# Altium project TIPD156 Project.PrjPcb
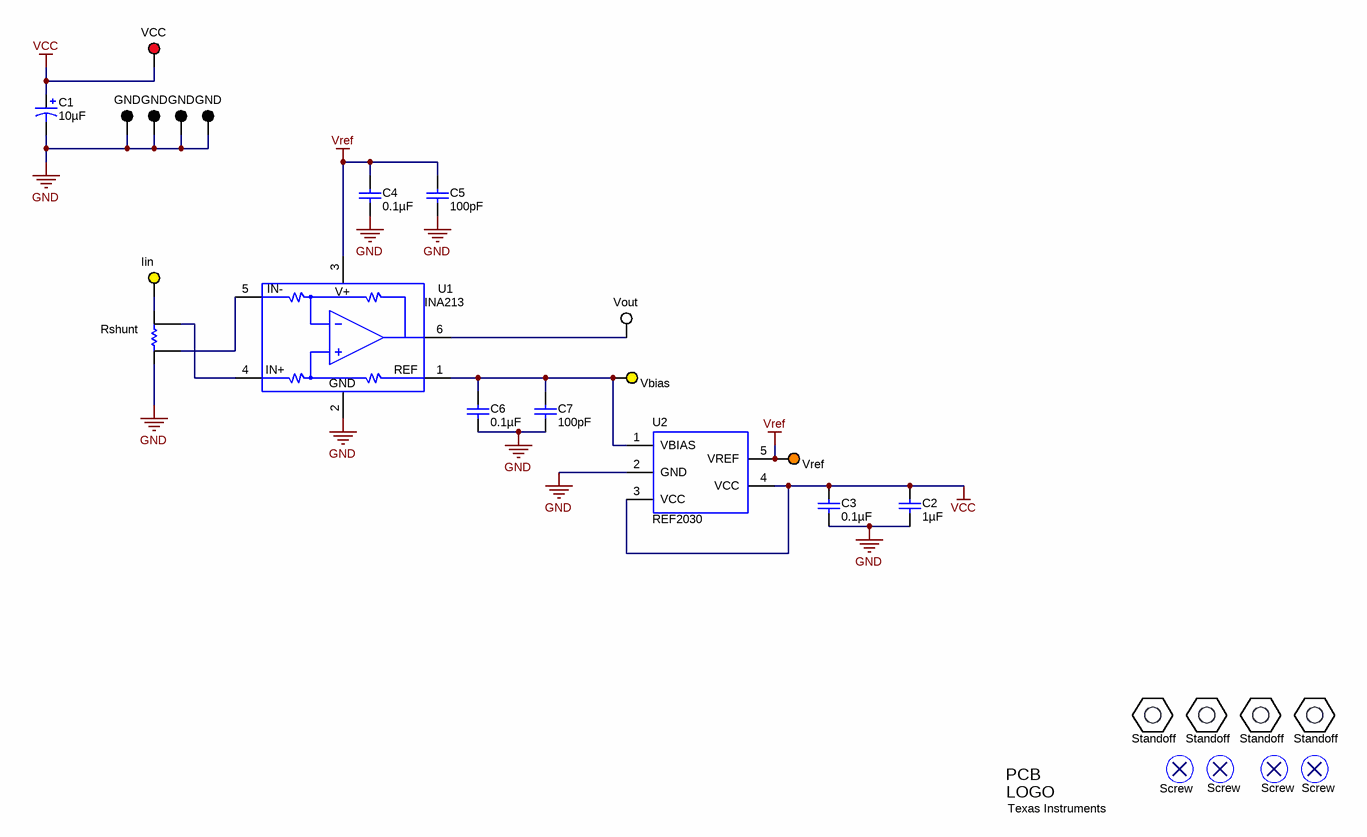
[diagram p0: TIPD156 SCH.SchDoc]
CopyrightYear: 2014; PRJ_Customer: Precision Linear; PRJ_Title: TI Designs - Precision; SCH_Rev: 0; TechSupport: http://e2e.ti.com
1 sheet, 28 parts. Net scope: global (net labels, ports and power ports of the same name join across sheets).
Board file: TIPD156 PCB.PcbDoc

## Sheet TIPD156 SCH.SchDoc: Schematic for TIPD156
size B; Date: Not shown in title block; ApprovedBy: Not shown in title block; CheckedBy: Not shown in title block; Author: Not shown in title block; CompanyName: Not shown in title block; DrawnBy: Not shown in title block; Engineer: Not shown in title block; Organization: Not shown in title block; Address1: Not shown in title block; Address2: Not shown in title block; Address3: Not shown in title block; Address4: Not shown in title block; DocumentNumber: 1; Revision: Use project parameter SCH_Rev; SheetNumber: 1; SheetTotal: 1; PageSetup: Record=PageOptions|CenterHorizontal=True|CenterVertical=True|PrintScale=0.72|XCorrection=1.00|YCorrection=1.00|PrintKind=0|BorderSize=5000000|LeftOffset=0|BottomOffset=0|Orientation=2|PaperLength=1000|PaperWidth=1000|Scale=100|PaperSource=15|PrintQuality=600|MediaType=1|DitherType=10|PaperKind=Letter|PrintScaleMode=1; CurrentTime: Not shown in title block; CurrentDate: Not shown in title block; Time: Not shown in title block; DocumentFullPathAndName: Not shown in title block; DocumentName: Not shown in title block; ModifiedDate: Not shown in title block; ImagePath: Not shown in title block

### Parts
C1  ValueDisplayed: 10µF  [6032-28]  (hidden comment: TPSC106K025R0500)
C2  ValueDisplayed: 1µF  [0603]  (hidden comment: C1608X7R1C105K)
C3  ValueDisplayed: 0.1µF  [0603]  (hidden comment: 06033C104KAT2A)
C4  ValueDisplayed: 0.1µF  [0603]  (hidden comment: 06033C104KAT2A)
C5  ValueDisplayed: 100pF  [0603]  (hidden comment: 06035A101JAT2A)
C6  ValueDisplayed: 0.1µF  [0603]  (hidden comment: 06033C104KAT2A)
C7  ValueDisplayed: 100pF  [0603]  (hidden comment: 06035A101JAT2A)
Logo1  Texas Instruments  [TI_Symbol_Overlay_Small]  (no BOM)
Rshunt  (no value)  [CSM2512]
TP1  Vout  [Keystone5007]
TP2  VCC  [Keystone5005]
TP3  GND  [Keystone5006]
TP4  GND  [Keystone5006]
TP5  GND  [Keystone5006]
TP6  GND  [Keystone5006]
TP7  Vbias  [Keystone5009]
TP8  Vref  [Keystone5008]
TP9  Iin  [Keystone5009]
U1  INA213  [SC70-6 (DCK) Low Density]
U2  REF2030  [SOT23-5 (DBV) low density]
U90  Standoff  [STANDOFF HEX 4-40THR ALUM 1"L]
U91  Standoff  [STANDOFF HEX 4-40THR ALUM 1"L]
U92  Standoff  [STANDOFF HEX 4-40THR ALUM 1"L]
U93  Standoff  [STANDOFF HEX 4-40THR ALUM 1"L]
U94  Screw  (mechanical)
U95  Screw  (mechanical)
U96  Screw  (mechanical)
U97  Screw  (mechanical)

### Nets
GND: C1.2(-) C2.2 C3.2 C4.2 C5.2 C6.2 C7.2 Rshunt.I2 TP3.1 TP4.1 TP5.1 TP6.1 U1.2(GND) U2.2(GND)
VCC: C1.1(+) C2.1 C3.1 TP2.1 U2.3(VCC) U2.4(VCC)
Vref: C4.1 C5.1 TP8.1 U1.3(V+) U2.5(VREF)
NetC6_1: C6.1 C7.1 TP7.1 U1.1 U2.1(VBIAS)
NetRshunt_E1: Rshunt.E1 U1.4
NetRshunt_E2: Rshunt.E2 U1.5
NetRshunt_I1: Rshunt.I1 TP9.1
NetTP1_1: TP1.1 U1.6

### Notes on the sheet
- Project:
- Designed for:
- Mod. Date:
- Sheet Title:
- Size:
- File:
- Assembly Variant:
- B
- Schematic:
- 870
- Rev:
- Sheet:
- of
- http://www.ti.com
- Texas Instruments and/or its licensors do not warrant the accuracy or completeness of this specification or any information contained therein. Texas Instruments and/or its licensors do not warrant that this design will meet the specifications, will be suitable for your application or fit for any particular purpose, or will operate in an implementation. Texas Instruments and/or its licensors do not warrant that the design is production worthy. You should completely validate and test your design implementation to confirm the system functionality for your application.
- Contact:
- © Texas Instruments
- (in symbol INA213) IN-; IN+; REF
- (in symbol TI_Logo) PCB; LOGO

### Library data of the parts
C1 = TPSC106K025R0500: CAP, TA, 10uF, 25V, +/-10%, 0.5 ohm, SMD; Manufacturer: AVX; Polarized: Y; CompType: Capacitor; U/M: EA; Cap_F: 0.00001; Tolerance_%: 10; Value1: 0.5 ohm; VDC_V: 25; ESR_Ohm: 0.5; IRMS_A: 0.422; TaMin_C: -55; TaMax_C: 125; Cap_Case: C; SymbolVersion: 2008-07-09; Value: 10uF; PartNumber: TPSC106K025R0500; PackageReference: 6032-28; RoHS: Y; Value2: 25V; MountType: SMT; Technology: TA; Series: TPS; Publisher: Texas Instruments; LatestRevisionDate: 2014-02-11; LatestRevisionNote: Updated supplier links; ComponentLink1Description: Datasheet link; ComponentLink1URL: http://www.avx.com/docs/masterpubs/tantniob.pdf; Supplier 1: Digi-Key; Supplier Part Number 1: 478-1762-1-ND; Supplier 2: Mouser; Supplier Part Number 2: 581-TPSC106K025R0500; Supplier 3: Farnell; Supplier Part Number 3: 570450
C2 = C1608X7R1C105K: CAP, CERM, 1uF, 16V, +/-10%, X7R, 0603; Manufacturer: TDK; Polarized: N; CompType: Capacitor; U/M: EA; Cap_F: 0.000001; Tolerance_%: 10; ESR_Ohm: 0.0057; Value1: 0.0057 ohm; VDC_V: 16; TaMin_C: -55; TaMax_C: 125; SymbolVersion: 2008-07-09; Value: 1uF; PartNumber: C1608X7R1C105K; PackageReference: 0603; RoHS: Y; Value2: 16V; MountType: SMT; Technology: Ceramic; TempCo: X7R; Cap_Case: 0603; Published: 2008-06-19; Publisher: Texas Instruments; LatestRevisionDate: 2014-02-27; ComponentLink1Description: Datasheet link; ComponentLink1URL: http://www.tdk.co.jp/tefe02/e412_c.pdf; Supplier 1: Digi-Key; Supplier Part Number 1: 445-1604-1-ND; Supplier 2: Farnell; Supplier Part Number 2: 1907343
C3 C4 C6 = 06033C104KAT2A: CAP, CERM, 0.1uF, 25V, +/-10%, X7R, 0603; Manufacturer: AVX; Polarized: N; CompType: Capacitor; U/M: EA; Cap_F: 0.0000001; Tolerance_%: 10; ESR_Ohm: 0.05; Value1: 0.05 ohm; VDC_V: 25; TaMin_C: -55; TaMax_C: 125; SymbolVersion: 2008-07-09; Value: 0.1uF; PartNumber: 06033C104KAT2A; PackageReference: 0603; RoHS: Y; Value2: 25V; MountType: SMT; Technology: Ceramic; TempCo: X7R; Cap_Case: 0603; Published: 2008-06-19; Publisher: Texas Instruments; LatestRevisionDate: 2014-02-27; ComponentLink1Description: Datasheet link; ComponentLink1URL: http://www.avx.com/docs/masterpubs/smccp.pdf; Supplier 1: Digi-Key; Supplier Part Number 1: 478-3714-1-ND; Supplier 2: Mouser; Supplier Part Number 2: 581-06033C104KAT2A; Supplier 3: Farnell; Supplier Part Number 3: 1396406
C5 C7 = 06035A101JAT2A: CAP, CERM, 100pF, 50V, +/-5%, C0G/NP0, 0603; Manufacturer: AVX; Polarized: N; CompType: Capacitor; U/M: EA; Cap_F: 0.0000000001; Tolerance_%: 5; ESR_Ohm: 0.119; Value1: 0.119 ohm; VDC_V: 50; TaMin_C: -55; TaMax_C: 125; SymbolVersion: 2008-07-09; Value: 100pF; PartNumber: 06035A101JAT2A; PackageReference: 0603; RoHS: Y; Value2: 50V; MountType: SMT; Technology: Ceramic; TempCo: C0G/NP0; Cap_Case: 0603; Published: 2008-06-19; Publisher: Texas Instruments; LatestRevisionDate: 2014-02-27; ComponentLink1Description: Datasheet link; ComponentLink1URL: http://www.avx.com/docs/masterpubs/smccp.pdf; Supplier 1: Digi-Key; Supplier Part Number 1: 478-1175-1-ND; Supplier 2: Mouser; Supplier Part Number 2: 581-06035A101J; Supplier 3: Farnell; Supplier Part Number 3: 499122
Logo1 = TI_Logo: Texas Instrument Corporate Signature; SymbolCreator: codlsc; SymbolVersion: 2011-08-22; ClassName: Logo; Published: 2009-03-03; Publisher: Texas Instruments; LatestRevisionDate: 2012-05-17; LatestRevisionNote: Changed publisher
Rshunt = 10m ohm shunt resistor: RES, 0.010 ohm, 0.1%, 1W, CSM2512; Res_ohm: 0.010; Tolerance_%: 1; U/M: EA; Value: 0.010; CompType: Resistor; SymbolVersion: 2009-05-29; PackageReference: CSM2512; RoHS: Y; Power_W: 1; MountType: SMT; Technology: Thick Film; Published: 2008-06-26; Publisher: Texas Instruments; LatestRevisionDate: 2014-02-25; ComponentLink1Description: Datasheet link
TP1 = 5007: Test Point, Compact, White, TH; Manufacturer: Keystone; CompType: Test Point Loop; U/M: EA; SymbolVersion: 2008-04-04; PartNumber: 5007; Value: White; PackageReference: White Compact Testpoint; RoHS: Y; MountType: TH; ComponentLink1Description: Datasheet Link; ComponentLink1URL: http://www.keyelco.com/userAssets/file/M60-2p60.pdf; Publisher: Texas Instruments; LatestRevisionDate: 2014-02-28; Supplier 1: Digi-Key; Supplier Part Number 1: 5007K-ND
TP2 = 5005: Test Point, TH, Compact, Red; Manufacturer: Keystone; Alternate Manufacturer: Any; Alternate PartNumber: Equivalent; CompType: Test Point Loop; U/M: EA; RoHS: Y; DigiKeyPartNumber: 5005K-ND; Value: Red; SymbolVersion: 2008-04-04; PartNumber: 5005; PackageReference: Keystone5005; ComponentLink1Description: Datasheet Link; ComponentLink1URL: http://www.keyelco.com/pdfs/M55p51.pdf; MountType: TH; Publisher: Texas Instruments; LatestRevisionDate: 2012-07-13; LatestRevisionNote: Changed publisher; Supplier 1: Digi-Key; Supplier Part Number 1: 5005K-ND
TP3-TP6 = 5006: Test Point, TH, Compact, Black; Manufacturer: Keystone; Alternate Manufacturer: Any; Alternate PartNumber: Equivalent; CompType: Test Point Loop; U/M: EA; RoHS: Y; DigiKeyPartNumber: 5006K-ND; Value: Black; SymbolVersion: 2008-04-04; PartNumber: 5006; PackageReference: Keystone5006; ComponentLink1Description: Datasheet Link; ComponentLink1URL: http://www.keyelco.com/pdfs/M55p51.pdf; MountType: TH; Publisher: Texas Instruments; LatestRevisionDate: 2012-07-13; LatestRevisionNote: Changed publisher; Supplier 1: Digi-Key; Supplier Part Number 1: 5006K-ND
TP7 TP9 = 5009: Test Point, Compact, Yellow, TH; Manufacturer: Keystone; CompType: Test Point Loop; U/M: EA; SymbolVersion: 2008-04-04; PartNumber: 5009; Value: Yellow; PackageReference: Yellow Compact Testpoint; RoHS: Y; MountType: TH; ComponentLink1Description: Datasheet Link; ComponentLink1URL: http://www.keyelco.com/userAssets/file/M60-2p60.pdf; Publisher: Texas Instruments; LatestRevisionDate: 2014-02-28; Supplier 1: Digi-Key; Supplier Part Number 1: 5009K-ND
TP8 = 5008: Test Point, Compact, Orange, TH; Manufacturer: Keystone; CompType: Test Point Loop; U/M: EA; SymbolVersion: 2008-04-04; PartNumber: 5008; Value: Orange; PackageReference: Orange Compact Testpoint; RoHS: Y; MountType: TH; ComponentLink1Description: Datasheet Link; ComponentLink1URL: http://www.keyelco.com/userAssets/file/M60-2p60.pdf; Publisher: Texas Instruments; LatestRevisionDate: 2014-02-28; Supplier 1: Digi-Key; Supplier Part Number 1: 5008K-ND
U1 = INA213: PartNumber: INA132U; Manufacturer: TI; Alternate Manufacturer: None; Area: 75900; Description: IC, Low Power, Single-Supply Differrence Amplifier; Value: INA132U; ComponentLink1URL: \\vette02\pmp_pcb\pcad_pdf's\ina132[1].pdf; SymbolVersion: 02/17/2010 08:15:09; PackageReference: SO8; ComponentHeight: 0.069 inch; ComponentLink1Description: AEO Datasheet Link
U2 = REF2030: Manufacturer: Texas Instruments; SymbolVersion: use current date i.e. 2008-05-20; SymbolCreator: Use a-id; CompType: Used in some BOM reports.  Useful for finding later.; U/M: EA, IN, or GM; MountType: SMT; RoHS: Used in BOM report.  Use Y or N.; PartNumber: REF2030; PackageReference: SOT23-5 (DBV); ComponentLink1Description: Datasheet Link; Alternate PartNumber: -; Alternate Manufacturer: -
U90-U93 = Standoff, 1", 4-40, Alum, F-F: STANDOFF HEX 4-40THR ALUM 1"L; Manufacturer: Keystone; PartNumber: 2205; SymbolVersion: use current date i.e. 2008-05-20; SymbolCreator: Use LDAP id; CompType: Used in some BOM reports.  Useful for finding later.; U/M: EA, IN, or GM; MountType: SMT, TH, or N/A; RoHS: Used in BOM report.  Use Y or N.; PackageReference: eg:  0603, used in PnP report; ComponentLink1Description: Datasheet Link; Alternate PartNumber: -; Alternate Manufacturer: -; Supplier 1: Digi-Key; Supplier Part Number 1: 2205K-ND
U94-U97 = Machine Screw, 4-40, 0.25": MACHINE SCREW PAN PHILLIPS 4-40; Manufacturer: B&F Fastener Supply; PartNumber: PMSSS 440 0025 PH; SymbolVersion: use current date i.e. 2008-05-20; SymbolCreator: Use LDAP id; CompType: Mechanical; U/M: EA, IN, or GM; MountType: SMT, TH, or N/A; RoHS: Used in BOM report.  Use Y or N.; PackageReference: eg:  0603, used in PnP report; ComponentLink1Description: Datasheet Link; Alternate PartNumber: -; Alternate Manufacturer: -; Supplier 1: Digi-Key; Supplier Part Number 1: H703-ND

## Assembly variants
-100A: all parts fitted